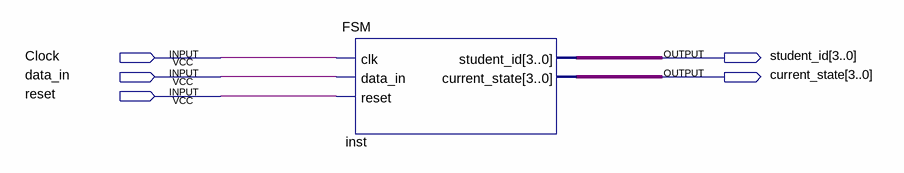
[diagram p0: schematic sheet]
// Quartus schematic individualBDF4.bdf as structural Verilog: 1 symbols, 5 pins
module individualBDF4 (
  input  Clock,
  input  data_in,
  input  reset,
  output [3:0] student_id,
  output [3:0] current_state
);

  FSM inst (.clk(Clock), .data_in(data_in), .reset(reset), .student_id(student_id), .current_state(current_state));
endmodule
